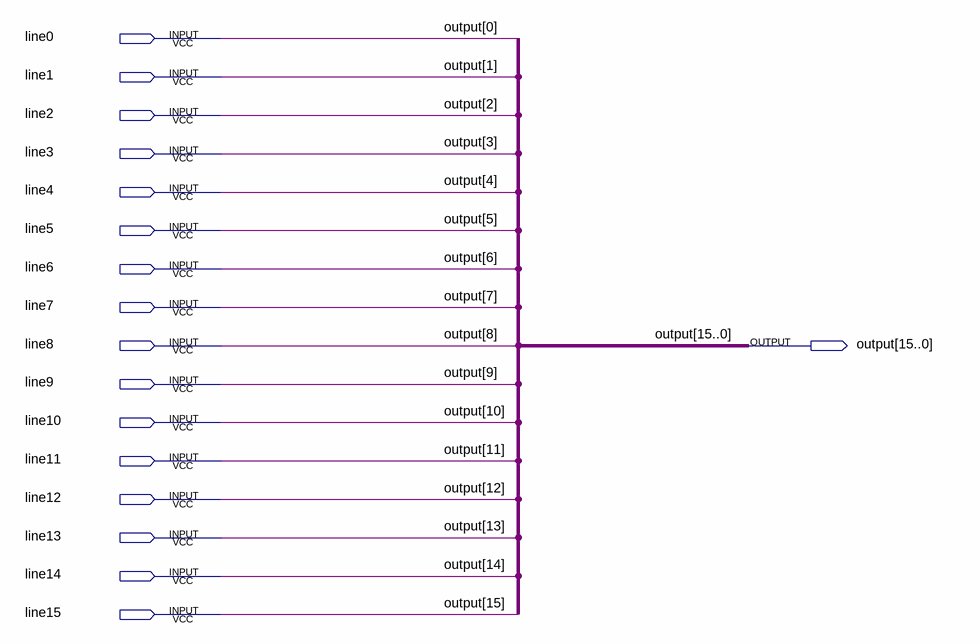
[diagram p0: schematic sheet]
// Quartus schematic bind.bdf as structural Verilog: 0 symbols, 17 pins
module \bind  (
  input  line0,
  input  line1,
  input  line2,
  input  line3,
  input  line4,
  input  line5,
  input  line6,
  input  line7,
  input  line8,
  input  line9,
  input  line10,
  input  line11,
  input  line12,
  input  line13,
  input  line14,
  input  line15,
  output [15:0] \output 
);


  assign \output  = {line15, line14, line13, line12, line11, line10, line9, line8, line7, line6, line5, line4, line3, line2, line1, line0};
endmodule
